# Altium schematic sheet 门禁触摸板.SchDoc
size A4; PageSetup: Record=PageOptions|CenterHorizontal=True|CenterVertical=True|PrintScale=0.52|XCorrection=1.00|YCorrection=1.00|PrintKind=0|BorderSize=5000000|LeftOffset=0|BottomOffset=0|Orientation=2|PaperLength=1000|PaperWidth=1000|Scale=100|PaperSource=7|PrintQuality=-4|MediaType=1|DitherType=10|PaperKind=A4|PrintScaleMode=1
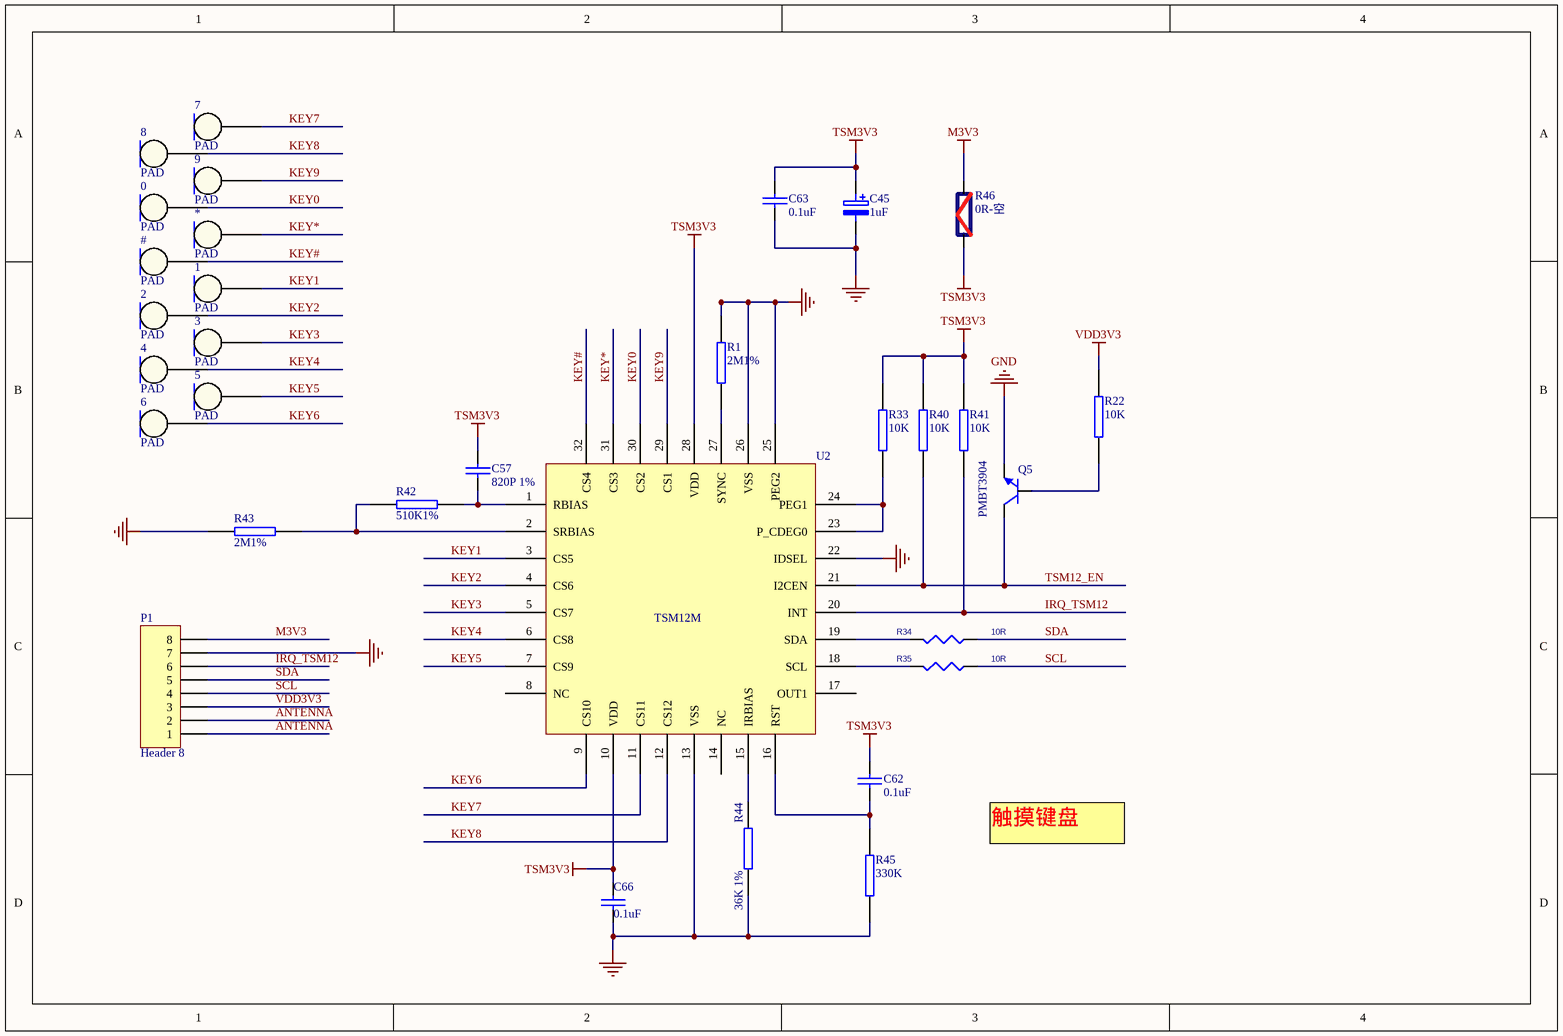
[diagram p0: 门禁触摸板.SchDoc]

## Parts
0  PAD  [焊盘1]
1  PAD  [焊盘1]
2  PAD  [焊盘1]
3  PAD  [焊盘1]
4  PAD  [焊盘1]
5  PAD  [焊盘1]
6  PAD  [焊盘1]
7  PAD  [焊盘1]
8  PAD  [焊盘1]
9  PAD  [焊盘1]
#  PAD  [焊盘1]
*  PAD  [焊盘1]
C45  1uF  [0603C]
C57  820P 1%  [0603C]
C62  0.1uF  [0603C]
C63  0.1uF  [0603C]
C66  0.1uF  [0603C]
P1  Header 8  [8P-1.25mm]
Q5  PMBT3904  [SOT-23-3L]
R1  2M1%  [0603R]
R22  10K  [0603R]
R33  10K  [0603R]
R34  10R  [0603R]
R35  10R  [0603R]
R40  10K  [0603R]
R41  10K  [0603R]
R42  510K1%  [0603R]
R43  2M1%  [0603R]
R44  36K 1%  [0603R]
R45  330K  [0603R]
R46  0R-空  [0603R]
U2  TSM12M  [ADS_TMS12]

## Nets
GND: C45.2 C63.1 C66.1 P1.7 Q5.2 R1.2 R43.1 R44.1 R45.1 U2.13(VSS) U2.22(IDSEL) U2.25(PEG2) U2.26(VSS)
M3V3: P1.8 R46.2
TSM3V3: C45.1 C57.2 C62.2 C63.2 C66.2 R33.2 R40.2 R41.2 R46.1 U2.10(VDD) U2.28(VDD)
VDD3V3: P1.3 R22.2
ANTENNA: P1.1 P1.2
IRQ_TSM12: P1.6 R41.1 U2.20(INT)
KEY0: 0.1 U2.30(CS2)
KEY1: 1.1 U2.3(CS5)
KEY2: 2.1 U2.4(CS6)
KEY3: 3.1 U2.5(CS7)
KEY4: 4.1 U2.6(CS8)
KEY5: 5.1 U2.7(CS9)
KEY6: 6.1 U2.9(CS10)
KEY7: 7.1 U2.11(CS11)
KEY8: 8.1 U2.12(CS12)
KEY9: 9.1 U2.29(CS1)
KEY#: #.1 U2.32(CS4)
KEY*: *.1 U2.31(CS3)
SCL: P1.4 R35.1
SDA: P1.5 R34.1
TSM12_EN: Q5.3 R40.1 U2.21(I2CEN)
NetC57_1: C57.1 R42.2 U2.1(RBIAS)
NetC62_1: C62.1 R45.2 U2.16(RST)
NetQ5_1: Q5.1 R22.1
NetR1_1: R1.1 U2.27(SYNC)
NetR33_1: R33.1 U2.23(P_CDEG0) U2.24(PEG1)
NetR34_2: R34.2 U2.19(SDA)
NetR35_2: R35.2 U2.18(SCL)
NetR42_1: R42.1 R43.2 U2.2(SRBIAS)
NetR44_2: R44.2 U2.15(IRBIAS)

Not connected (* = marked no-connect by the designer): U2 8(NC) 14(NC) 17(OUT1)

## Notes on the sheet
- 触摸键盘

## Library data of the parts
0-9 # * = TestPoint: Test Point
C45 = C-C?: Electrolytic Capacitor
C57 C62 C63 C66 = CAP: Capacitor
P1 = Header 8: Header, 8-Pin; LatestRevisionDate: 17-Jul-2002; LatestRevisionNote: Re-released for DXP Platform.; Publisher: Altium Limited
Q5 = NPN_BJT: Bipolar Junction Transistor
R1 R22 R33 R40-R45 = RES2
R34 R35 = R_Dup1
R46 = POWER-R